# EAGLE design M_O_ext_bluetooth_WT5105 (EAGLE 9.6.2)
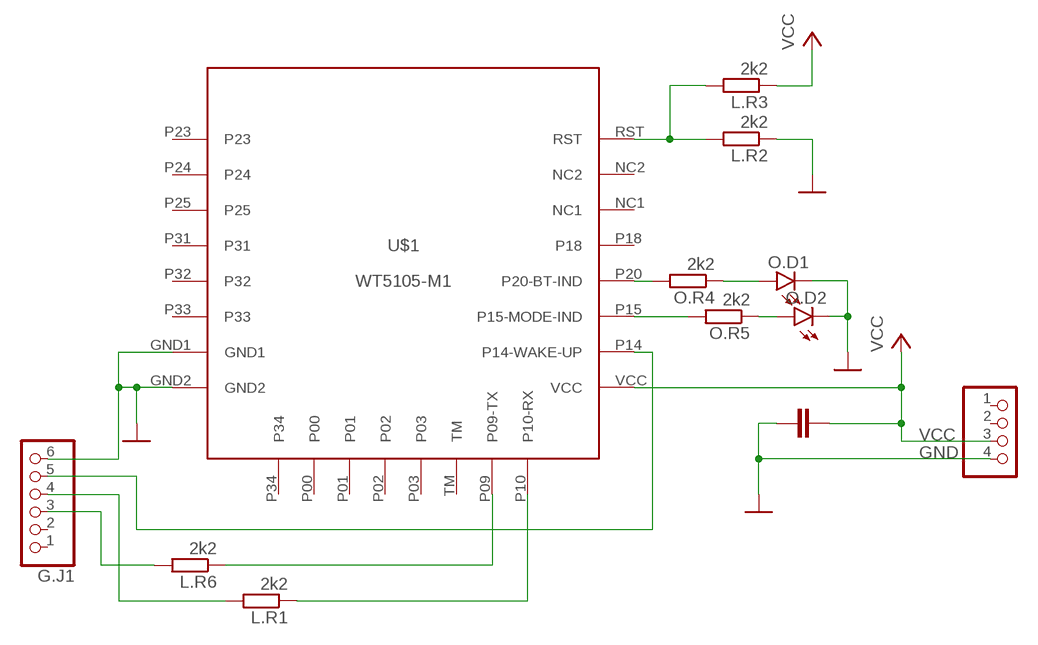
[diagram p0: schematic, sheet 1]

## Parts
G.J1  PINHD-1X6  [1X06]
G.J2  PINHD-1X4  [1X04]
L.C1  100n  C-EUC0603  [C0603]
L.R1  2k2  R-EU_R0603  [R0603]
L.R2  2k2  R-EU_R0603  [R0603]
L.R3  2k2  R-EU_R0603  [R0603]
L.R6  2k2  R-EU_R0603  [R0603]
O.D1  LEDCHIP-LED0603  [CHIP-LED0603]
O.D2  LEDCHIP-LED0603  [CHIP-LED0603]
O.R4  2k2  R-EU_R0603  [R0603]
O.R5  2k2  R-EU_R0603  [R0603]
U$1  WT5105-M1  [WT5105-M1]

## Nets
GND: G.J1.6 G.J2.4 L.C1.1 L.R2.1 O.D1.C1(C) O.D2.C1(C) U$1.GND1 U$1.GND2
N$2: G.J1.4 L.R1.2
N$3: L.R1.1 U$1.P10(P10-RX)
N$4: G.J1.5 U$1.P14(P14-WAKE-UP)
N$5: L.R2.2 L.R3.2 U$1.RST
N$6: O.R4.2 U$1.P20(P20-BT-IND)
N$7: L.R6.1 U$1.P09(P09-TX)
N$8: O.R5.2 U$1.P15(P15-MODE-IND)
N$9: O.D1.A1(A) O.R4.1
N$10: O.D2.A1(A) O.R5.1
VCC: G.J2.3 L.C1.2 L.R3.1 U$1.VCC
VCC1: G.J1.3 L.R6.2
Unconnected: G.J1.1 G.J1.2 G.J2.1 G.J2.2 U$1.NC1 U$1.NC2 U$1.P00 U$1.P01 U$1.P02 U$1.P03 U$1.P18 U$1.P23 U$1.P24 U$1.P25 U$1.P31 U$1.P32 U$1.P33 U$1.P34 U$1.TM

## Library data of the parts
G.J1 = pinhead2:PINHD-1X6: PIN HEADER
G.J2 = pinhead2:PINHD-1X4: PIN HEADER
L.C1 = rcl:C-EU: CAPACITOR, European symbol; SPICEPREFIX: C
L.R1-L.R3 L.R6 O.R4 O.R5 = rcl:R-EU_: RESISTOR, European symbol; SPICEPREFIX: R
O.D1 O.D2 = led:LED: LED OSRAM: - CHIPLED LG R971, LG N971, LY N971, LG Q971, LY Q971, LO R971, LY R971 LH N974, LH R974 LS Q976, LO Q976, LY Q976 LO Q996 - Hyper CHIPLED LW Q18S LB Q993, LB Q99A, LB R99A - SideLED LS A670, LO A670, LY A670, LG A670, LP A670 LB A673, LV A673, LT A673, LW A673 LH A674 LY A675 LS A676, LA A676, LO A676, LY A676, LW A676 LS A679, LY A679, LG A679 - Hyper Micro SIDELED® LS Y876, LA Y876, LO Y876, LY Y876 LT Y87S - SmartLED LW L88C, LW L88S LB L89C, LB L89S, LG L890 LS L89K, LO L89K, LY L89K LS L896, LA L896, LO L896, LY L896 - TOPLED LS T670, LO T670, LY T670, LG T670, LP T670 LSG T670, LSP T670, LSY T670, LOP T670, LYG T670 LG T671, LOG T671, LSG T671 LB T673, LV T673, LT T673, LW T673 LH T674 LS T676, LA T676, LO T676, LY T676, LB T676, LH T676, LSB T676, LW T676 LB T67C, LV T67C, LT T67C, LS T67K, LO T67K, LY T67K, LW E67C LS E67B, LA E67B, LO E67B, LY E67B, LB E67C, LV E67C, LT E67C LW T67C LS T679, LY T679, LG T679 LS T770, LO T770, LY T770, LG T770, LP T770 LB T773, LV T773, LT T773, LW T773 LH T774 LS E675, LA E675, LY E675, LS T675 LS T776, LA T776, LO T776, LY T776, LB T776 LHGB T686 LT T68C, LB T68C - Hyper Mini TOPLED® LB M676 - Mini TOPLED Santana® LG M470 LS M47K, LO M47K, LY M47K Source: http://www.osram.convergy.de LUXEON: - LUMILED® LXK2-PW12-R00, LXK2-PW12-S00, LXK2-PW14-U00, LXK2-PW14-V00 LXK2-PM12-R00, LXK2-PM12-S00, LXK2-PM14-U00 LXK2-PE12-Q00, LXK2-PE12-R00, LXK2-PE12-S00, LXK2-PE14-T00, LXK2-PE14-U00 LXK2-PB12-K00, LXK2-PB12-L00, LXK2-PB12-M00, LXK2-PB14-N00, LXK2-PB14-P00, LXK2-PB14-Q00 LXK2-PR12-L00, LXK2-PR12-M00, LXK2-PR14-Q00, LXK2-PR14-R00 LXK2-PD12-Q00, LXK2-PD12-R00, LXK2-PD12-S00 LXK2-PH12-R00, LXK2-PH12-S00 LXK2-PL12-P00, LXK2-PL12-Q00, LXK2-PL12-R00 Source: www.luxeon.com KINGBRIGHT: KA-3528ASYC Source: www.kingbright.com
U$1 = hugo:WT5105-M1

## Board
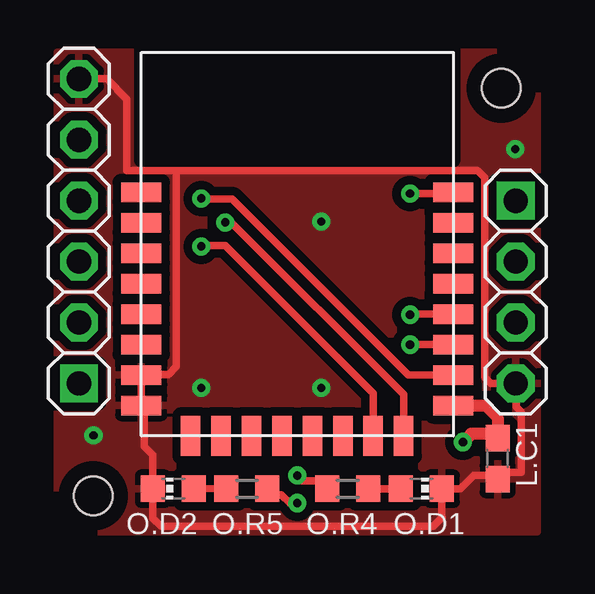
[diagram p1: board, top side]
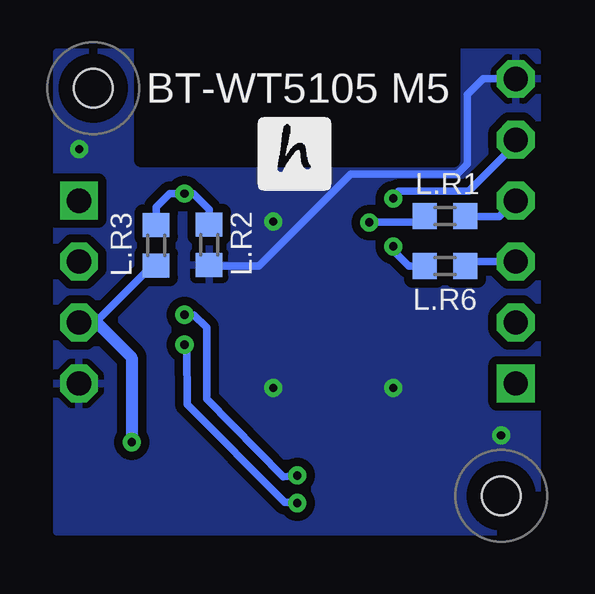
[diagram p2: board, bottom side, seen from below]

No outline drawn. Coordinates in mm, seen from the top.
Copper layers (1*16): Top 0.035mm / dielectric 1.5mm / Bottom 0.035mm
Design rules "default *": minimum track width 12mil, minimum drill 0.35mm, track to track 14mil, track to pad 13mil, pad to pad 10mil, via to via 14mil, smd to smd 14mil, copper to edge 15mil, drill to drill 15mil, minimum pad ring 10mil, minimum via ring 8mil, stop-mask expansion 4mil, vias tented up to drill 0mil, thermal gap 10mil
Holes 1.6 mm at 2,2 19,19
tRestrict: area 18,18 to 20,20; area 1,1 to 3,3
bRestrict: area 1,1 to 3,3; area 18,18 to 20,20

### Footprints (pad centres in the part's own frame; a part is rotated, then mirrored left to right if it is on the bottom)
1X06 = drill 1.016 pad 1.575 square: 1 -6.35,0 | drill 1.016 pad 1.575 octagon: 2 -3.81,0; 3 -1.27,0; 4 1.27,0; 5 3.81,0; 6 6.35,0
1X04 = drill 1.016 pad 1.575 square: 1 -3.81,0 | drill 1.016 pad 1.575 octagon: 2 -1.27,0; 3 1.27,0; 4 3.81,0
C0603 = smd 1.1 x 1: 1 -0.85,0; 2 0.85,0
R0603 = smd 1 x 1.1: 1 -0.85,0; 2 0.85,0
CHIP-LED0603 = smd 1.1 x 1: A1 0,-0.85; C1 0,0.85
WT5105-M1 = smd 1.676 x 0.813: GND1 0,2.54; GND2 0,1.27; NC1 13,7.62; NC2 13,8.89; P14 13,2.54; P15 13,3.81; P18 13,6.35; P20 13,5.08; P23 0,10.16; P24 0,8.89; P25 0,7.62; P31 0,6.35; P32 0,5.08; P33 0,3.81; RST 13,10.16; VCC 13,1.27 | smd 0.813 x 1.676: P00 3.325,0; P01 4.595,0; P02 5.865,0; P03 7.135,0; P09 9.655,0; P10 10.925,0; P34 2.055,0; TM 8.405,0

### Placement (x,y rotation side)
G.J1  1.4,13.04 90 top
G.J2  19.6,10.5 270 top
L.C1  18.85,3.56 90 top
L.R1  4.34,13.67 0 bottom
L.R2  14.17,12.47 90 bottom
L.R3  16.38,12.45 90 bottom
L.R6  4.34,11.58 0 bottom
O.D1  15.67,2.3 270 top
O.D2  5.33,2.3 90 top
O.R4  12.6,2.3 180 top
O.R5  8.4,2.3 0 top
U$1  4,4.5 0 top

### Tracks (layer width: path | path; a pad name or v marks a point on that pad's centre or on a via)
GND  (via drill 0.35)
  Top 0.305: 5.46,15.57 5.46,7.39 5.14,7.07 4.03,7.07 U$1.GND1 U$1.GND2 4.13,5.64 4.13,4.06 4.49,3.71 O.D2.C1 4.48,1.07 4.83,0.72 16.16,0.72 16.54,1.1 16.52,1.15 O.D1.C1 17.3,2.3 17.86,2.86 18.69,2.86 L.C1.1 19.13,2.98 19.83,2.98 19.83,5.5 19.62,5.7 19.62,6.67 G.J2.4 18.56,6.69 18.32,6.93 18.32,15.27 18.02,15.57 5.46,15.57 | 5.46,15.57 3.4,15.57 3.4,18.54 2.56,19.39 G.J1.6
  Bottom 0.305: G.J1.6 2.76,19.39 3.42,18.73 3.42,15.84 3.83,15.42 8.27,15.42 12.11,11.58 14.13,11.58 L.R2.1
  other vias: 19.58,16.46 2.01,4.52 11.5,13.44 11.5,6.5 6.5,6.5
  pour Top (isolate 0.305): 0.5,20.5 0.5,0.5 20.5,0.5 20.5,20.5
  pour Bottom (isolate 0.305): 0.5,20.5 0.5,0.5 20.53,0.5 20.53,20.5
N$2
  Bottom 0.305: G.J1.4 1.43,14.31 2.08,13.65 3.48,13.65 L.R1.2
N$3  (via drill 0.35)
  Top 0.305: 15.02,4.41 U$1.P10 14.94,6.22 7.76,13.4 v7.5,13.4
  Bottom 0.305: L.R1.1 5.19,13.41 7.49,13.41 v7.5,13.4
N$4  (via drill 0.35)
  Top 0.305: v6.5,14.4 6.52,14.38 7.79,14.38 15.13,7.04 U$1.P14
  Bottom 0.305: v6.5,14.4 6.5,14.52 6.28,14.71 3.35,14.71 1.4,16.66 G.J1.5
N$5  (via drill 0.35)
  Top 0.305: v15.2,14.61 16.95,14.61 U$1.RST
  Bottom 0.305: L.R2.2 14.17,13.95 14.83,14.61 v15.2,14.61 15.81,14.61 16.38,14.03 L.R3.2
N$6  (via drill 0.35)
  Top 0.305: O.R4.2 11.41,2.62 10.68,2.62 v10.5,2.85 | v15.2,9.55 15.19,9.58 U$1.P20
  Bottom 0.305: v10.5,2.85 11.08,2.8 14.27,6.04 14.27,9.01 14.81,9.55 v15.2,9.55
N$7  (via drill 0.35)
  Top 0.305: U$1.P09 13.66,4.49 13.66,6.27 7.49,12.45 6.55,12.45 v6.5,12.4
  Bottom 0.305: v6.5,12.4 6.5,12.22 5.86,11.58 L.R6.1
N$8  (via drill 0.35)
  Top 0.305: O.R5.2 9.5,2.05 9.84,2.05 10.22,1.68 v10.5,1.7 | v15.2,8.3 v15.2,8.31 U$1.P15
  Bottom 0.305: v10.5,1.7 10.52,1.74 11.02,1.74 15.09,5.81 15.1,8.2 v15.2,8.3
N$9
  Top 0.305: O.D1.A1 O.R4.1
N$10
  Top 0.305: O.R5.1 6.04,2.31 O.D2.A1
VCC  (via drill 0.35)
  Top 0.305: 18.5,4.06 L.C1.2
  Top 0.508: U$1.VCC 18.35,5.77 18.85,5.27 L.C1.2 18.67,4.58 17.74,4.58 v17.4,4.24
  Bottom 0.305: L.R3.1 16.55,11.6 18.91,9.23 G.J2.3
  Bottom 0.508: v17.4,4.24 17.4,7.77 18.86,9.23 G.J2.3
VCC1
  Bottom 0.305: L.R6.2 3.31,11.77 G.J1.3

### Text on the board
bPlace: BT-WT5105 M5